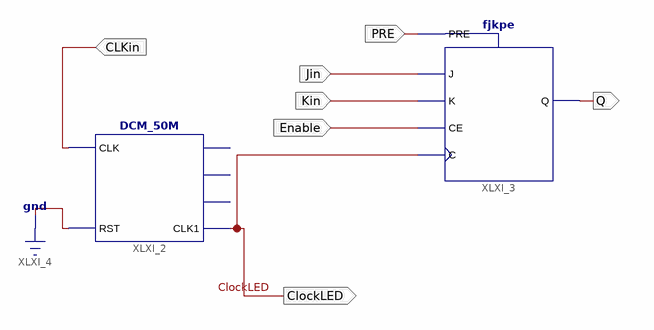
[diagram p0: schematic sheet 1]
// Xilinx ISE schematic lab7_experiment7_2.sch (spartan3e) as structural Verilog: 2 symbols, 7 ports
module lab7_experiment7_2 (
  input  CLKin,
  input  Enable,
  input  Kin,
  input  Jin,
  input  PRE,
  output ClockLED,
  output Q
);

  DCM_50M XLXI_2 (.CLK(CLKin), .RST(1'b0), .CLK1(ClockLED));  // open: CLK1M, CLK10k, CLK1k
  fjkpe XLXI_3 (.C(ClockLED), .CE(Enable), .J(Jin), .K(Kin), .PRE(PRE), .Q(Q));
endmodule
